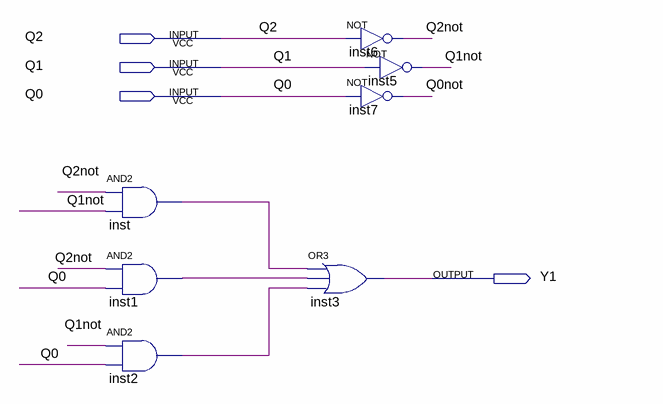
[diagram p0: schematic sheet]
// Quartus schematic Y1.bdf as structural Verilog: 7 symbols, 4 pins
module Y1 (
  input  Q2,
  input  Q1,
  input  Q0,
  output Y1
);

  wire inst1_out, inst2_out, inst_out, Q0not, Q1not, Q2not;

  and inst (inst_out, Q2not, Q1not);
  and inst1 (inst1_out, Q2not, Q0);
  and inst2 (inst2_out, Q1not, Q0);
  or inst3 (Y1, inst_out, inst1_out, inst2_out);
  not inst6 (Q2not, Q2);
  not inst5 (Q1not, Q1);
  not inst7 (Q0not, Q0);
endmodule
